# EAGLE design imu_minized (EAGLE 9.6.2)
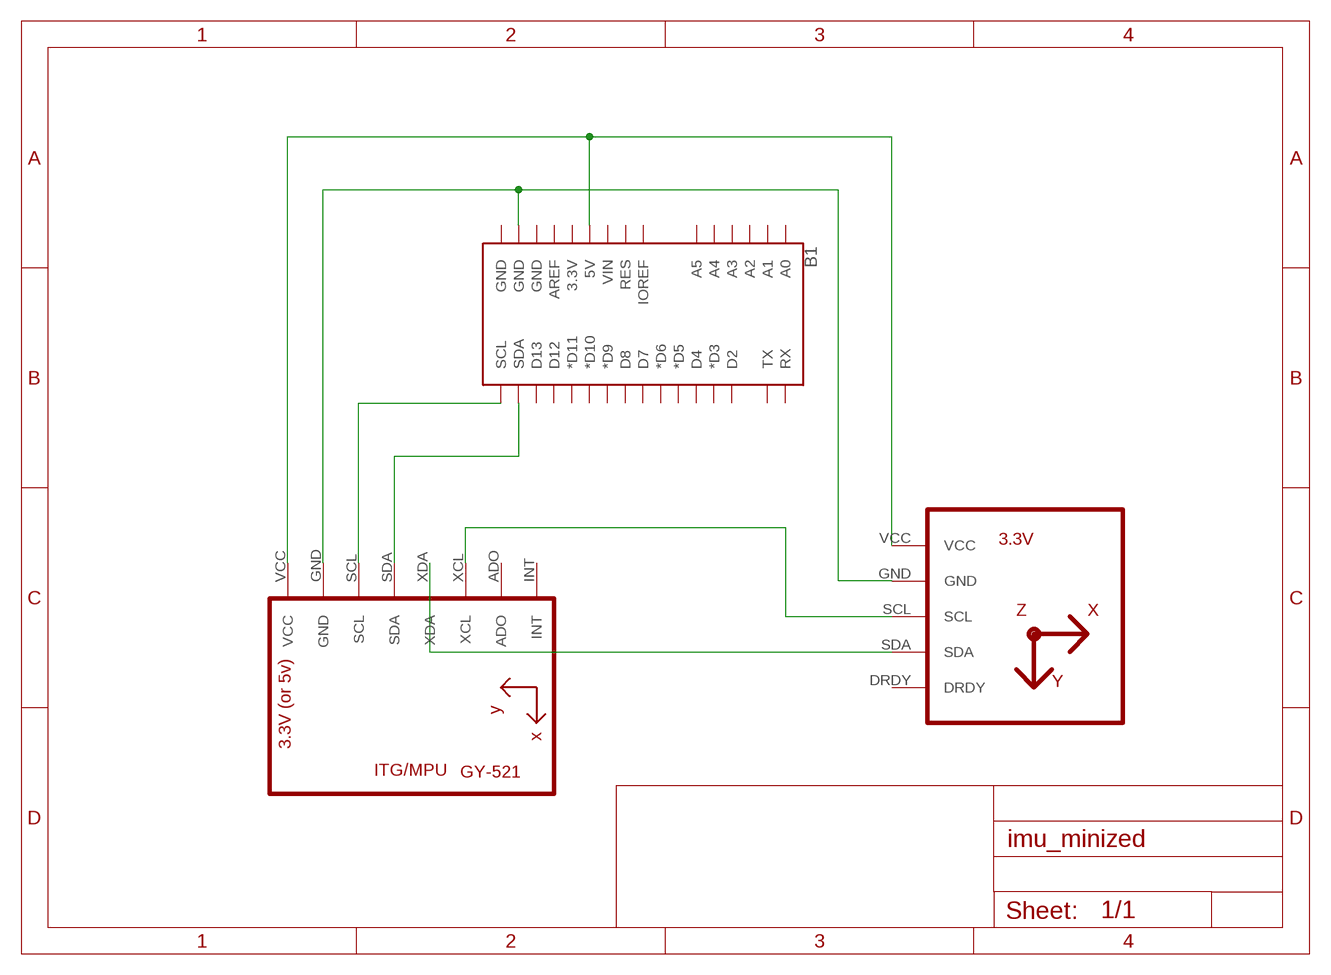
[diagram p0: schematic, sheet 1]

## Parts
B1  ARDUINO_UNO_R3_SHIELDNOLABELS  [UNO_R3_SHIELD_NOLABELS]
U1  GY-521MPU6050  [GY-521]
U2  HMC5883LGY-271  [GY-271]

## Nets
N$1: B1.5V U1.VCC U2.VCC
N$2: B1.GND@1(GND) U1.GND U2.GND
N$3: B1.SCL U1.SCL
N$4: B1.SDA U1.SDA
N$5: U1.XDA U2.SDA
N$6: U1.XCL U2.SCL
Unconnected: B1.3.3V B1.A0 B1.A1 B1.A2 B1.A3 B1.A4 B1.A5 B1.AREF B1.D2 B1.D3(*D3) B1.D4 B1.D5(*D5) B1.D6(*D6) B1.D7 B1.D8 B1.D9(*D9) B1.D10(*D10) B1.D11(*D11) B1.D12 B1.D13 B1.GND@0(GND) B1.GND@2(GND) B1.IOREF B1.RES B1.RX B1.TX B1.VIN U1.ADO U1.INT U2.DRDY

## Library data of the parts
B1 = SparkFun-Boards:ARDUINO_UNO_R3_SHIELD: Arduino R3 Shield Footprint Shield form compatible with the Arduino Uno R3. SparkFun Products: MG2639 Cellular Shield <https://www.sparkfun.com/products/13120> MIDI Shield <https://www.sparkfun.com/products/12898> R3 Stackable Headers Kit <https://www.sparkfun.com/products/11417>
U1 = gy-521:GY-521
U2 = hmc5883l:HMC5883L

## Board
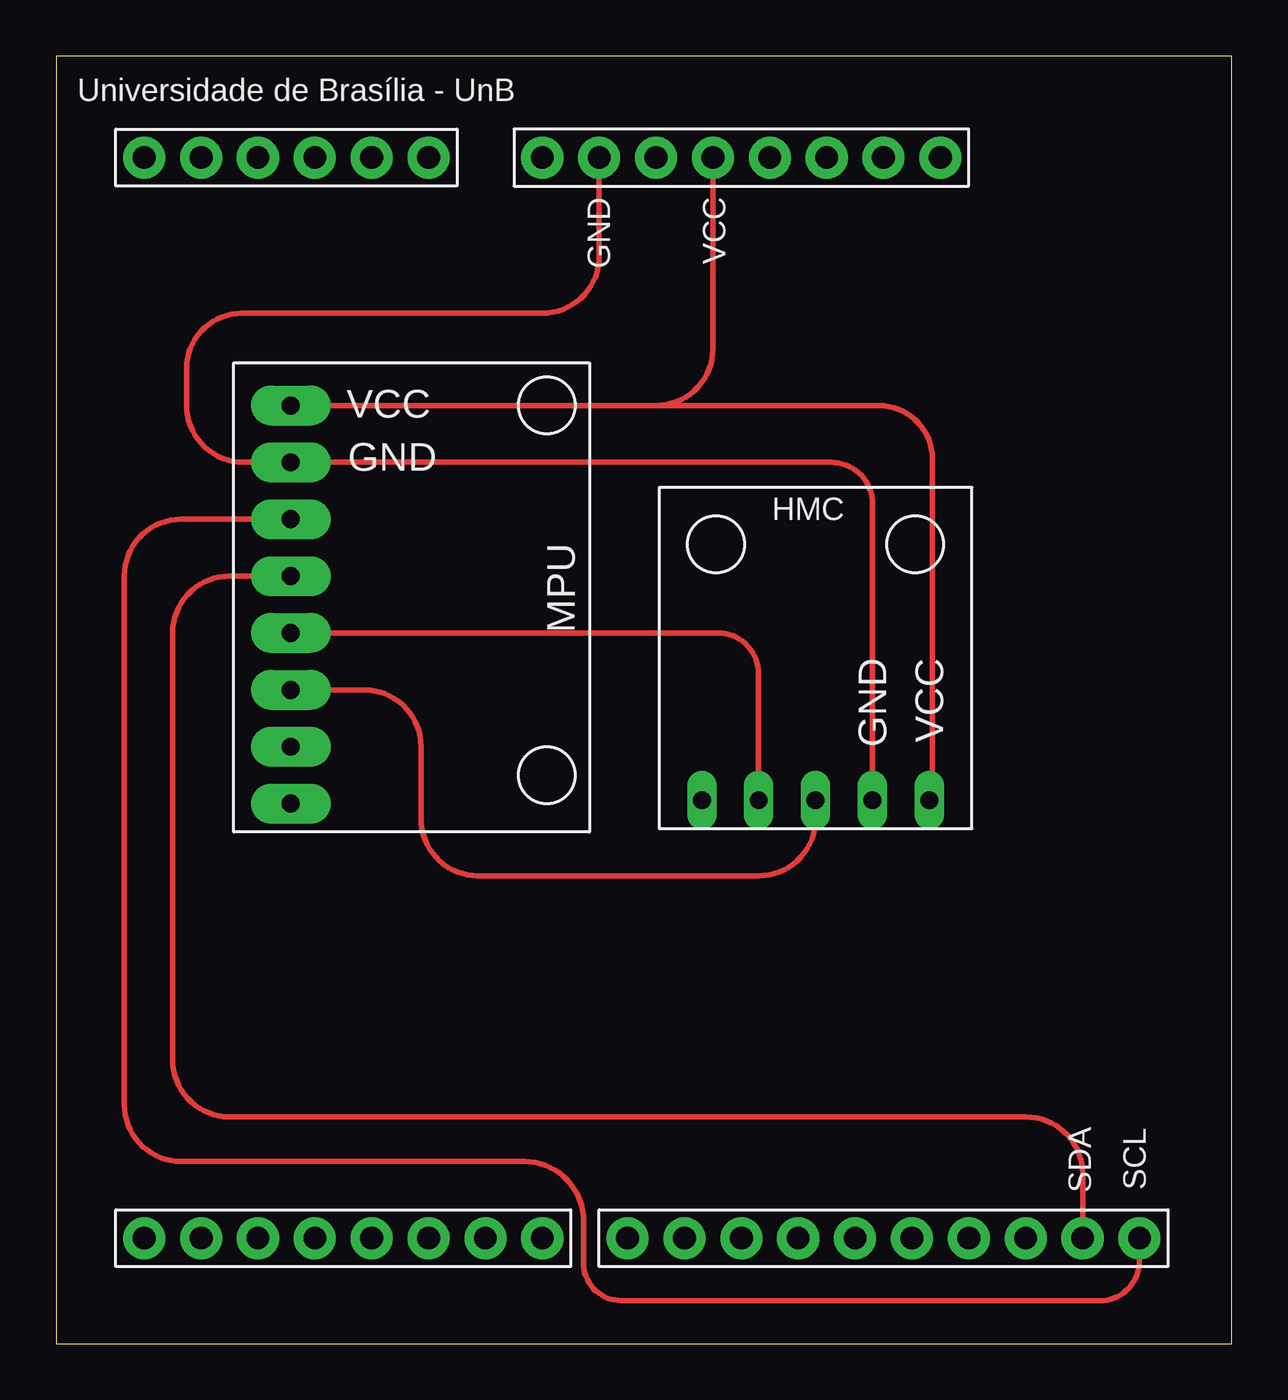
[diagram p1: board, top side]

Size 52.5 x 57.5 mm. Coordinates in mm from the lower left corner, seen from the top.
Outline: 0,0 52.5,0 52.5,57.5 0,57.5 0,0
Copper layers (1*16): Top 0.035mm / dielectric 1.5mm / Bottom 0.035mm
Design rules "default": minimum track width 6mil, minimum drill 0.35mm, track to track 6mil, track to pad 6mil, pad to pad 6mil, via to via 6mil, smd to smd 6mil, copper to edge 40mil, drill to drill 6mil, minimum pad ring 10mil, minimum via ring 8mil, stop-mask expansion 4mil, vias tented up to drill 0mil, thermal gap 10mil

### Footprints (pad centres in the part's own frame; a part is rotated, then mirrored left to right if it is on the bottom)
UNO_R3_SHIELD_NOLABELS = drill 1.016 pad 1.88: 3.3V 24.13,-3.81; 5V 24.13,-1.27; A0 24.13,11.43; A1 24.13,13.97; A2 24.13,16.51; A3 24.13,19.05; A4 24.13,21.59; A5 24.13,24.13; AREF -24.13,-15.24; D2 -24.13,19.05; D3 -24.13,16.51; D4 -24.13,13.97; D5 -24.13,11.43; D6 -24.13,8.89; D7 -24.13,6.35; D8 -24.13,2.54; D9 -24.13,0; D10 -24.13,-2.54; D11 -24.13,-5.08; D12 -24.13,-7.62; D13 -24.13,-10.16; GND@0 24.13,1.27; GND@1 24.13,3.81; GND@2 -24.13,-12.7; IOREF 24.13,-8.89; NC 24.13,-11.43; RES 24.13,-6.35; RX -24.13,24.13; SCL -24.13,-20.32; SDA -24.13,-17.78; TX -24.13,21.59; VIN 24.13,6.35
GY-521 = drill 0.8 pad 1.778 long: ADO -8.89,-6.35; GND -8.89,6.35; INT -8.89,-8.89; SCL -8.89,3.81; SDA -8.89,1.27; VCC -8.89,8.89; XCL -8.89,-3.81; XDA -8.89,-1.27
GY-271 = drill 0.8 long: DRDY -6.35,-4.445; GND -6.35,3.175; SCL -6.35,0.635; SDA -6.35,-1.905; VCC -6.35,5.715

### Placement (x,y rotation side)
B1  28.07,28.83 90 top
U1  19.37,33 0 top
U2  33.29,30.62 90 bottom

### Tracks (layer width: path | path; a pad name or v marks a point on that pad's centre or on a via)
N$1
  Top 0.254: U2.VCC 39.15,24.41 39.15,39.49 arc90 36.74,41.89 26.8,41.89 | U1.VCC 26.8,41.89 | B1.5V 29.34,44.43 arc-90 26.8,41.89
N$2
  Top 0.254: U2.GND 36.46,37.51 arc90 34.62,39.35 U1.GND 8.38,39.35 arc-90 5.84,41.89 5.84,43.55 arc-90 8.29,46.01 21.72,46.01 arc90 24.26,48.55 B1.GND@1
N$3
  Top 0.254: U1.SCL 5.59,36.81 arc90 3.05,34.27 3.05,10.67 arc90 5.59,8.13 20.9,8.13 arc-90 23.57,5.47 23.55,3.62 arc90 25.25,1.91 45.6,1.91 arc90 45.6,1.91 46.62,1.91 arc90 48.39,3.69 B1.SCL
N$4
  Top 0.254: U1.SDA 7.75,34.27 arc90 5.21,31.73 5.21,12.66 arc90 7.75,10.12 43.31,10.12 arc-90 45.85,7.58 B1.SDA
N$5
  Top 0.254: U1.XDA 29.54,31.73 arc-90 31.38,29.89 U2.SDA
N$6
  Top 0.254: U1.XCL 13.77,29.19 arc-90 16.3,26.65 16.3,23.43 arc90 18.84,20.89 31.38,20.89 arc90 33.92,23.43 U2.SCL

### Text on the board
tPlace: Universidade de Brasília - UnB | GND | VCC | HMC | SDA | SCL